# EAGLE design 214_oled_A (EAGLE 9.6.2)
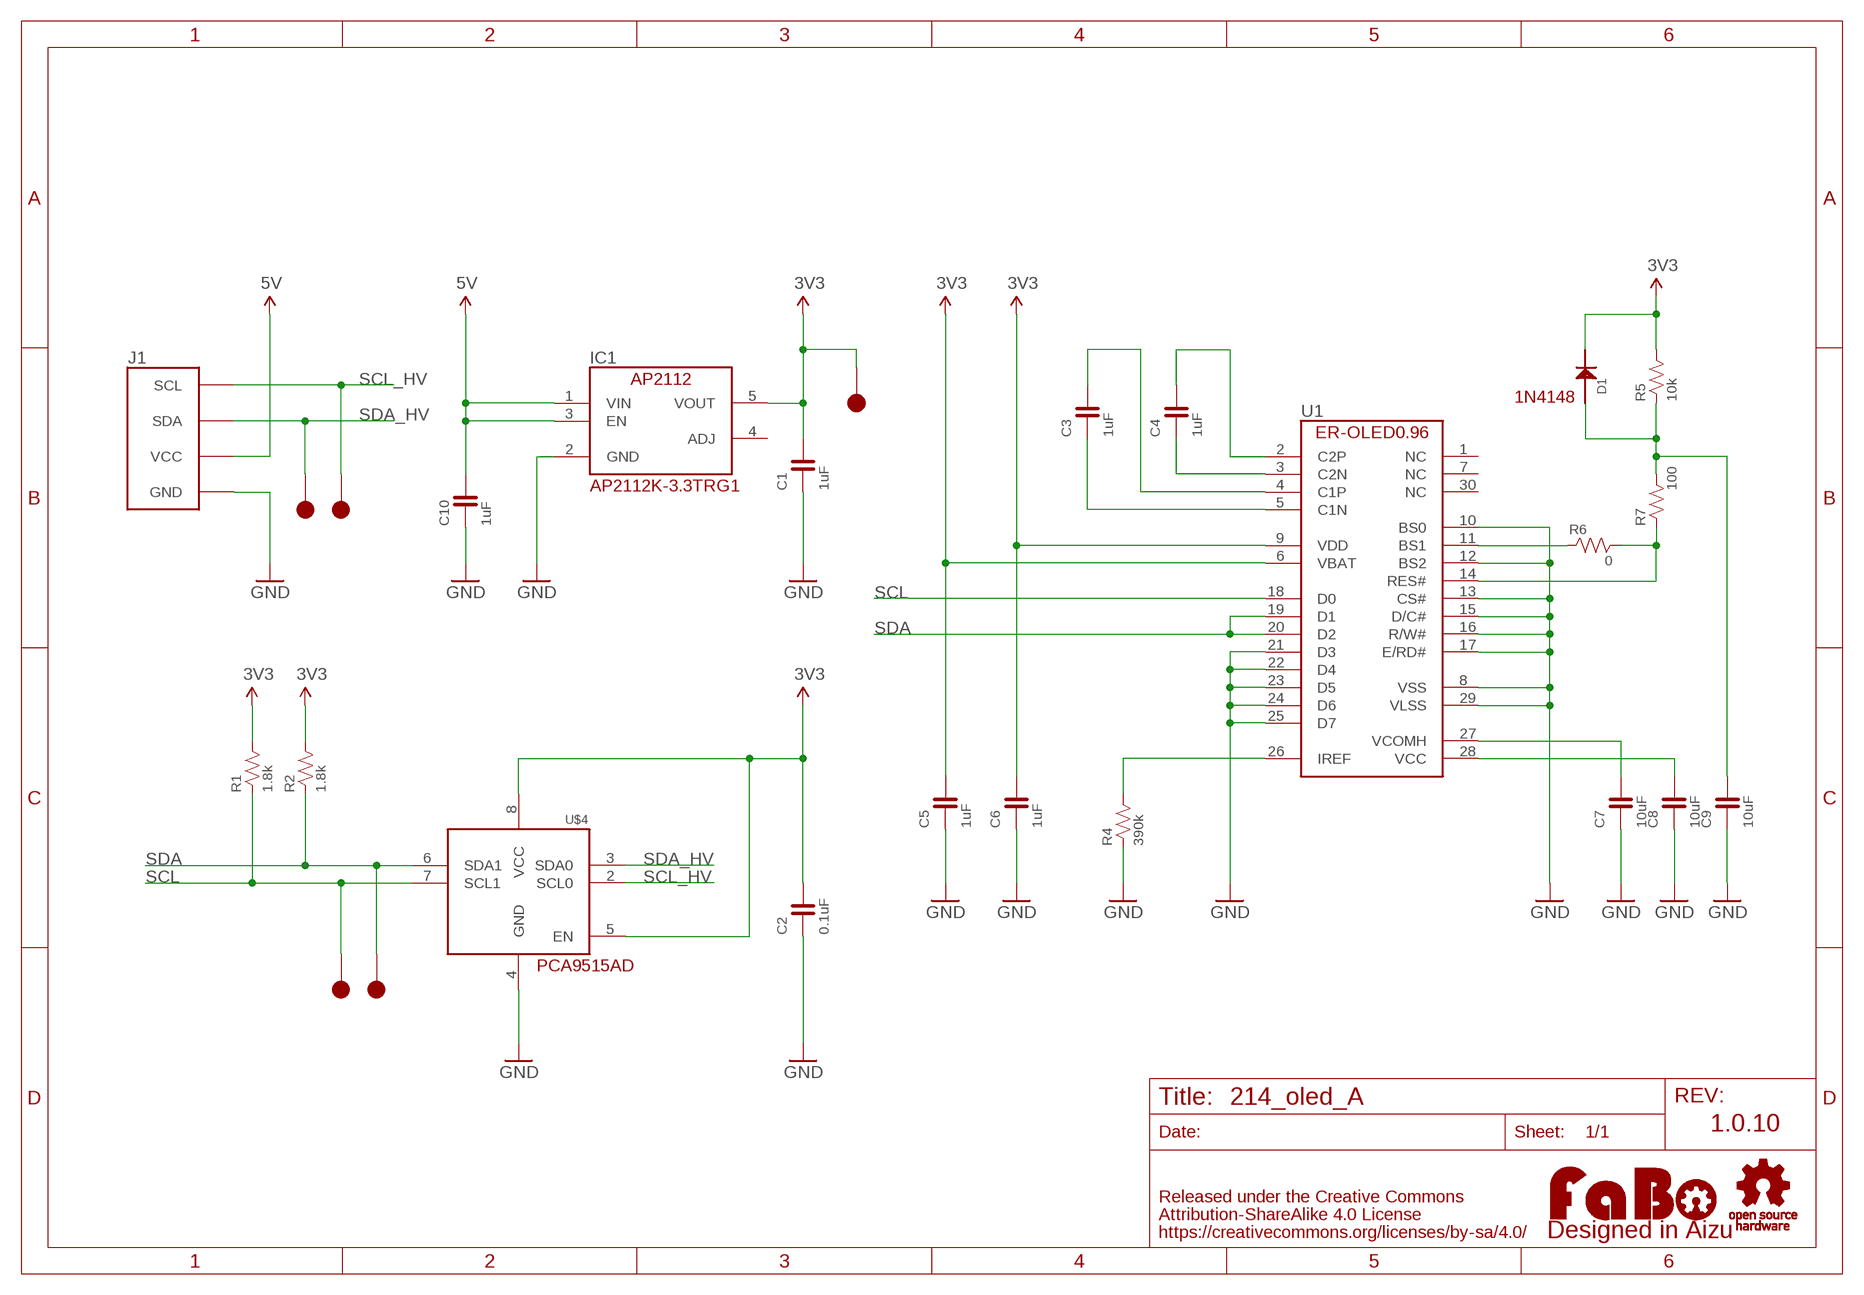
[diagram p0: schematic, sheet 1]

## Parts
C1  1uF  CAPACITOR-0603  [0603]
C2  0.1uF  CAPACITOR-0603  [0603]
C3  1uF  CAPACITOR-0603  [0603]
C4  1uF  CAPACITOR-0603  [0603]
C5  1uF  CAPACITOR-0603  [0603]
C6  1uF  CAPACITOR-0603  [0603]
C7  10uF  CAPACITOR-0603  [0603]
C8  10uF  CAPACITOR-0603  [0603]
C9  10uF  CAPACITOR-0603  [0603]
C10  1uF  CAPACITOR-0603  [0603]
D1  1N4148  [1N4148W]
IC1  AP2112K-3.3TRG1  [SOT-23-5]
J1  FABO_BRICK_I2C-OLED  [FABO_BRICK_I2C_OLED]
LOGO1  LOGO_FABO-M_BOTTOM  [LOGO_FABO_M_BOTTOM]
R1  1.8k  RESISTOR-0603  [0603]
R2  1.8k  RESISTOR-0603  [0603]
R4  390k  RESISTOR-0603  [0603]
R5  10k  RESISTOR-0603  [0603]
R6  0  RESISTOR-0603  [0603]
R7  100  RESISTOR-0603  [0603]
TP1  TP-15  [TP-15]
TP2  TP-15  [TP-15]
TP3  TP-15  [TP-15]
TP4  TP-15  [TP-15]
TP5  TP-15  [TP-15]
U1  ER-OLED0.96-1  [ER-OLED0.96-1]
U$2  LOGO_OSHW-M  [LOGO_OSHW_M]
U$4  PCA9515  [SO8]

## Nets
3V3: C1.2 C2.2 C5.2 C6.2 D1.CATHODE IC1.5(VOUT) R1.2 R2.2 R5.2 TP5.1 U1.6(VBAT) U1.9(VDD) U$4.5(EN) U$4.8(VCC)
5V: C10.2 IC1.1(VIN) IC1.3(EN) J1.VCC
GND: C1.1 C2.1 C5.1 C6.1 C7.1 C8.1 C9.1 C10.1 IC1.2(GND) J1.GND R4.1 U1.8(VSS) U1.10(BS0) U1.12(BS2) U1.13(CS#) U1.15(D/C#) U1.16(R/W#) U1.17(E/RD#) U1.21(D3) U1.22(D4) U1.23(D5) U1.24(D6) U1.25(D7) U1.29(VLSS) U$4.4(GND)
N$1: C3.2 U1.4(C1P)
N$2: C3.1 U1.5(C1N)
N$3: C4.1 U1.3(C2N)
N$4: C4.2 U1.2(C2P)
N$5: R4.2 U1.26(IREF)
N$6: C7.2 U1.27(VCOMH)
N$7: C8.2 U1.28(VCC)
N$9: R6.1 U1.11(BS1)
N$10: R6.2 R7.1 U1.14(RES#)
N$12: C9.2 D1.ANODE R5.1 R7.2
SCL: R1.1 TP2.1 U1.18(D0) U$4.7(SCL1)
SCL_HV: J1.SCL TP4.1 U$4.2(SCL0)
SDA: R2.1 TP1.1 U1.19(D1) U1.20(D2) U$4.6(SDA1)
SDA_HV: J1.SDA TP3.1 U$4.3(SDA0)
Unconnected: IC1.4(ADJ) U1.1(NC) U1.7(NC) U1.30(NC)

## Notes on the sheet
- 1N4148
- AP2112K-3.3TRG1
- PCA9515AD
- 1.0.10

## Library data of the parts
C1-C10 = FaBo-Capacitor:CAPACITOR: CAPACITOR
D1 = FaBo-Diode:1N4148
IC1 = FaBo-Supply:AP2112
J1 = FaBo-Template:FABO_BRICK_I2C: FaBo Brick I2C
LOGO1 = component:LOGO_FABO
R1 R2 R4-R7 = FaBo-Resistors:RESISTOR: RESISTOR
TP1-TP5 = FaBo-Supply:TP
U1 = FaBo-Parts:ER-OLED0.96-1
U$2 = FaBo-etc:LOGO_OSHW
U$4 = FaBo-Repeater:PCA9515

## Board
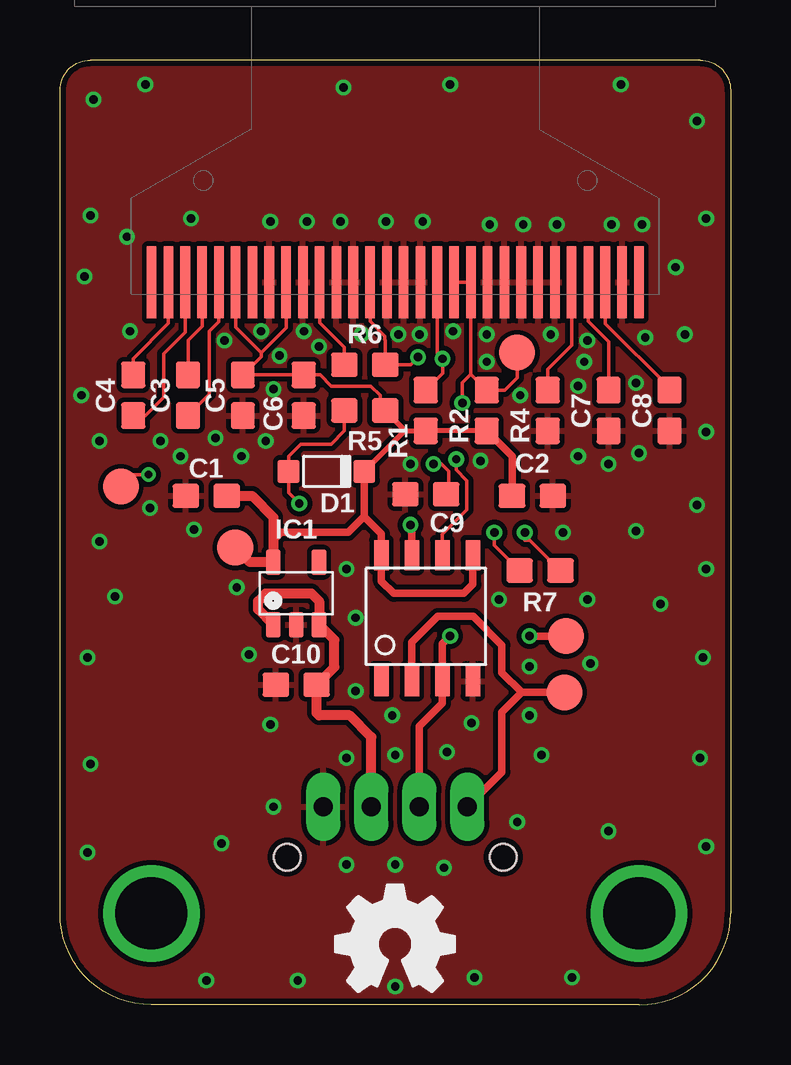
[diagram p1: board, top side]
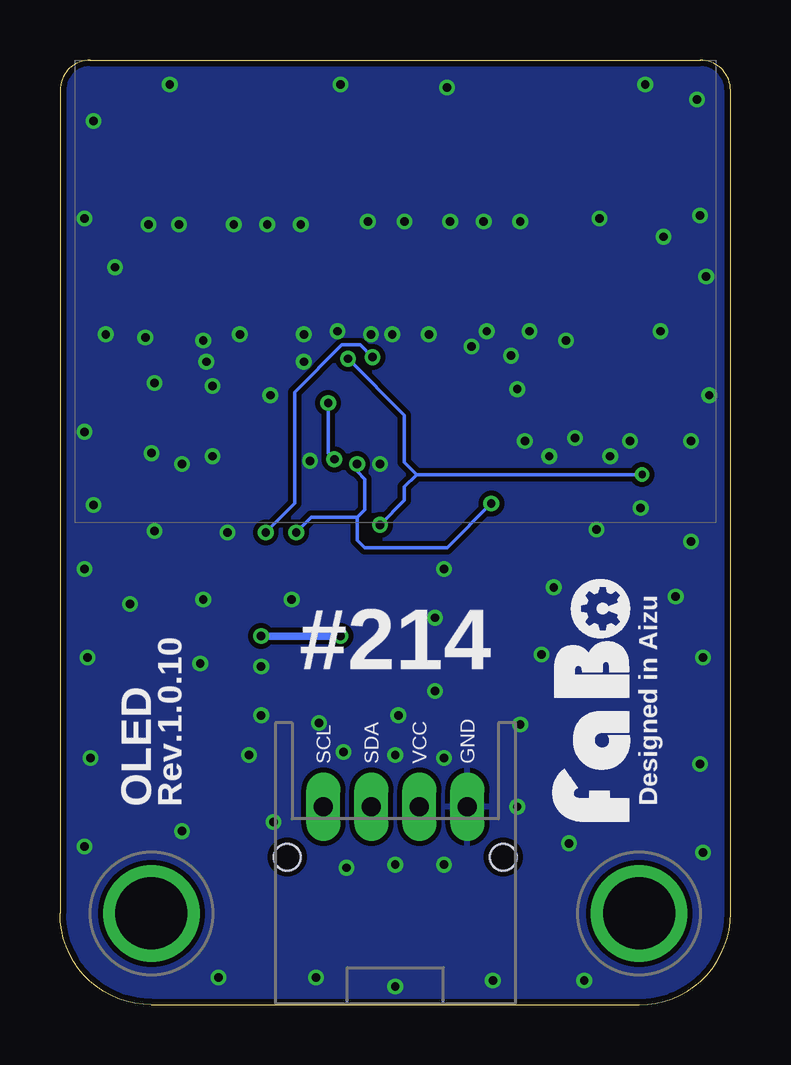
[diagram p2: board, bottom side, seen from below]

Size 27.94 x 39.37 mm. Coordinates in mm from the lower left corner, seen from the top.
Copper layers (1*16): Top 0.035mm / dielectric 1.6mm / Bottom 0.035mm
Design rules "PCBway": minimum track width 6mil, minimum drill 12mil, track to track 6mil, track to pad 6mil, pad to pad 6mil, via to via 6mil, smd to smd 6mil, copper to edge 10mil, drill to drill 10mil, minimum pad ring 10mil, minimum via ring 6mil, stop-mask expansion 2mil, vias tented up to drill 100mil, thermal gap 8mil

### Footprints (pad centres in the part's own frame; a part is rotated, then mirrored left to right if it is on the bottom)
0603 = smd 1.1 x 1: 1 -0.85,0; 2 0.85,0
1N4148W = smd 0.9 x 0.95: ANODE 0,0; CATHODE 3.15,0
SOT-23-5 = smd 0.6 x 1.05: 1 -0.95,-1.3; 2 0,-1.3; 3 0.95,-1.3; 4 0.95,1.3; 5 -0.95,1.3
FABO_BRICK_I2C_OLED = drill 0.8 pad 1.422 long: GND 3,-10.795; SCL -3,-10.795; SDA -1,-10.795; VCC 1,-10.795 | drill 3 pad 3.81: P$1 -10.16,-15.24; P$2 10.16,-15.24 | hole 1.1: -4.5,-12.895; 4.5,-12.895
TP-15 = smd 1.5 x 1.5: 1 0,0
ER-OLED0.96-1 = smd 0.4 x 3: 1 -10.15,-0.5; 2 -9.45,-0.5; 3 -8.75,-0.5; 4 -8.05,-0.5; 5 -7.35,-0.5; 6 -6.65,-0.5; 7 -5.95,-0.5; 8 -5.25,-0.5; 9 -4.55,-0.5; 10 -3.85,-0.5; 11 -3.15,-0.5; 12 -2.45,-0.5; 13 -1.75,-0.5; 14 -1.05,-0.5; 15 -0.35,-0.5; 16 0.35,-0.5; 17 1.05,-0.5; 18 1.75,-0.5; 19 2.45,-0.5; 20 3.15,-0.5; 21 3.85,-0.5; 22 4.55,-0.5; 23 5.25,-0.5; 24 5.95,-0.5; 25 6.65,-0.5; 26 7.35,-0.5; 27 8.05,-0.5; 28 8.75,-0.5; 29 9.45,-0.5; 30 10.15,-0.5
SO8 = smd 0.6 x 1.25: 1 -1.85,-2.7; 2 -0.58,-2.7; 3 0.69,-2.7; 4 1.96,-2.7; 5 1.96,2.55; 6 0.69,2.55; 7 -0.58,2.55; 8 -1.85,2.55

### Placement (x,y rotation side)
C1  6.1,21.21 0 top
C2  19.68,21.21 180 top
C3  5.33,25.4 90 top
C4  3.05,25.4 90 top
C5  7.62,25.4 90 top
C6  10.16,25.4 90 top
C7  22.86,24.77 90 top
C8  25.4,24.77 90 top
C9  15.24,21.27 0 top
C10  9.84,13.34 0 top
D1  9.53,22.23 0 top
IC1  9.84,17.14 0 top
J1  13.97,19.05 0 bottom
LOGO1  3.81,12.7 270 top
R1  15.24,24.77 270 top
R2  17.78,24.77 270 top
R4  20.32,24.77 90 top
R5  12.7,24.77 0 top
R6  12.7,26.67 0 top
R7  20,18.1 180 top
TP1  19.05,27.18 0 top
TP2  2.54,21.59 0 top
TP3  21.08,15.37 0 top
TP4  21.02,13.02 0 top
TP5  7.3,19.05 0 top
U1  13.97,30.61 0 top
U$2  13.97,2.54 0 top
U$4  15.24,16.19 0 top

### Tracks (layer width: path | path; a pad name or v marks a point on that pad's centre or on a via)
3V3
  Top 0.152: 13.34,24.98 13.34,25.4 12.95,25.78 11.3,25.78 10.83,26.25 C6.2 C5.2 8.38,27.01 8.38,27.18 | U1.9 9.42,28.22 8.38,27.18 | U1.6 7.32,28.24 8.38,27.18
  Top 0.203: R2.2 R1.2 14.37,23.91 | D1.CATHODE 14.37,23.91 | 14.37,23.91 14.37,23.95 R5.2 13.34,24.98
  Top 0.305: D1.CATHODE 12.68,20.34 | 12.68,20.34 12.67,20.35 12,19.68 9.21,19.68 8.89,19.37 | R2.2 18.84,22.86 C2.2 | U$4.5 17.2,17.52 16.83,17.14 13.91,17.14 13.39,17.66 U$4.8 13.39,19.63 12.68,20.34
  Top 0.406: TP5.1 7.91,18.45 IC1.5 8.89,19.37 8.89,20.32 8,21.21 C1.2
5V
  Top 0.406: J1.VCC 12.97,11.16 12.06,12.06 10.79,12.06 10.69,12.17 C10.2 11.43,14.07 11.43,15.21 IC1.3 10.79,16.83 10.48,17.14 8.57,17.14 8.26,16.83 8.26,16.48 IC1.1
GND  (via drill 0.35)
  other vias: 17.78,27.94 21.97,27.69 14.1,27.94 26.04,27.94 8.57,23.5 20.95,19.68 22.86,22.54 14.61,22.54 17.14,11.75 20.45,27.94 14.99,27.94 12.57,27.94 10.79,27.43 10.16,28.07 8.38,28.07 17.53,22.67 16.38,28.07 9.14,27.05 6.86,27.69 6.48,23.62 8.89,25.65 4.19,23.5 1.65,23.5 2.92,28.07 2.79,32 1.02,30.35 0.89,25.4 8.76,32.64 10.29,32.64 11.68,32.64 13.59,32.64 15.11,32.64 5.46,32.77 17.91,32.51 19.3,32.51 20.7,32.51 22.99,32.51 24.26,32.51 25.65,30.73 24.38,27.81 24,25.91 21.84,26.8 19.18,25.4 21.59,22.86 24.13,22.99 26.92,23.88 5.59,19.81 1.65,19.3 11.94,18.16 7.37,17.4 12.32,16.13 19.56,14.1 12.32,13.08 13.84,12.06 16.13,10.54 13.97,10.41 11.94,10.29 8.76,11.68 7.87,14.61 8.89,8.26 11.94,5.84 13.97,5.84 16,5.71 19.05,7.62 20.07,10.41 26.92,6.6 22.86,7.24 21.34,1.14 17.27,1.14 13.97,0.76 9.91,1.02 6.1,1.02 1.14,6.35 6.73,6.73 26.67,10.29 26.8,14.48 26.92,18.16 26.54,20.83 1.27,10.03 1.14,14.48 2.29,17.02 26.92,32.77 1.27,32.89 1.4,37.72 3.56,38.35 23.37,38.35 26.54,36.83 11.81,38.23 16.26,38.35 17.78,26.8 21.59,25.78 19.56,12.06 22.1,14.22 21.97,16.89 18.29,16.89 7.56,22.86 5.02,22.86 3.75,20.7 24,19.75 25.02,16.7
  pour Bottom (isolate 0.203): 0,0 27.94,0 27.94,39.37 0,39.37
  pour Top (isolate 0.203): 0,0 27.94,0 27.94,39.37 0,39.37
N$1
  Top 0.152: U1.4 5.92,28.27 5.33,27.69 C3.2
N$2
  Top 0.152: U1.5 6.62,28.46 6.22,28.07 6.22,25.44 C3.1
N$3
  Top 0.152: C4.1 3.56,24.55 4.32,25.31 4.32,27.13 5.22,28.03 U1.3
N$4
  Top 0.152: U1.2 4.52,28.4 3.05,26.92 C4.2
N$5
  Top 0.152: U1.26 21.32,27.49 20.32,26.49 R4.2
N$6
  Top 0.152: C7.2 22.86,27.64 22.02,28.48 U1.27
N$7
  Top 0.152: C8.2 25.4,25.7 22.72,28.39 U1.28
N$9
  Top 0.152: U1.11 10.82,28.42 11.85,27.39 R6.1
N$10  (via drill 0.35)
  Top 0.152: v14.92,26.99 14.61,26.67 R6.2 13.55,27.7 13.54,27.71 13.54,27.86 12.92,28.48 U1.14 | R7.1 19.58,19.37 19.37,19.37 v19.37,19.68
  Bottom 0.152: v19.37,19.68 18.16,20.89 18.16,25.53 16.19,27.5 15.43,27.5 v14.92,26.99
N$12  (via drill 0.35)
  Top 0.152: R7.2 18.1,19.15 v18.1,19.68 | C9.2 15.98,21.38 16.19,21.59 16.19,22.23 15.88,22.54 v15.56,22.54 | R5.1 11.85,23.91 11.3,23.37 10.03,23.37 9.53,22.86 D1.ANODE 9.53,21.34 v9.97,20.89
  Bottom 0.152: v18.1,19.68 17.46,20.32 15.56,20.32 | 15.56,20.32 15.24,20.64 15.24,21.91 15.56,22.23 v15.56,22.54 | 15.56,20.32 15.56,19.37 15.24,19.05 11.81,19.05 v9.97,20.89
SCL  (via drill 0.3, 0.35)
  Top 0.152: U1.18 15.72,27.14 v15.94,26.92 15.94,26.31 R1.1 | TP2.1 3.05,22.1 v3.68,22.1
  Top 0.305: v14.61,20 14.66,19.95 U$4.7
  Bottom 0.152: v15.94,26.92 13.59,24.57 13.59,22.61 13.08,22.1 | v14.61,20 13.59,21.02 13.59,21.59 13.08,22.1 | 13.08,22.1 v3.68,22.1
SCL_HV
  Top 0.305: J1.SCL 18.41,9.7 18.41,12.19 19.24,13.02 | U$4.2 14.66,15.1 15.75,16.19 17.21,16.19 18.41,14.99 18.41,13.84 19.24,13.02 | TP4.1 19.24,13.02
SDA  (via drill 0.35)
  Top 0.152: TP1.1 19.05,26.14 18.53,25.61 R2.1 17.12,26.27 | v16.51,22.73 16.51,22.29 16.95,21.84 16.95,20.64 15.93,19.61 U$4.6 | U1.19 U1.20 17.12,26.27 | v16.76,25.08 16.76,25.92 17.12,26.27
  Bottom 0.152: v16.76,25.08 16.76,22.99 v16.51,22.73
SDA_HV  (via drill 0.35)
  Top 0.305: J1.SDA 14.97,11.6 15.93,12.56 U$4.3 15.93,15.04 v16.26,15.37 | TP3.1 v19.56,15.37
  Bottom 0.305: v16.26,15.37 v19.56,15.37

### Text on the board
bPlace: #214 | Designed in Aizu | Rev.1.0.10 | OLED